# Altium schematic sheet adapter_board.SchDoc
size A3; SheetNumber: 2; SheetTotal: 3
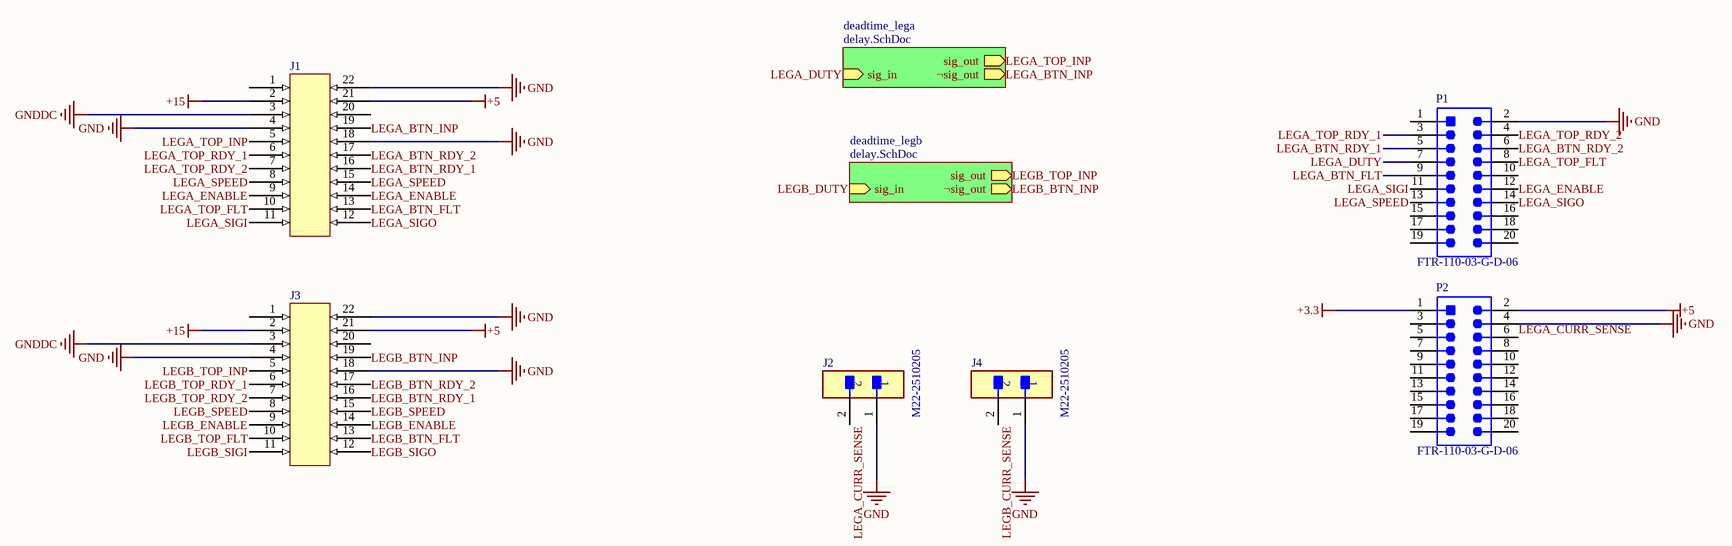
[diagram p0: adapter_board.SchDoc]

## Parts
J1  header_22_milligrid  [header_22_milligrid]  (value not drawn)
J2  M22-2510205  [FP-M22-2510205-MFG]
J3  header_22_milligrid  [header_22_milligrid]  (value not drawn)
J4  M22-2510205  [FP-M22-2510205-MFG]
P1  FTR-110-03-G-D-06  [SMTC-FTR-110-03-G-D-06_V]
P2  FTR-110-03-G-D-06  [SMTC-FTR-110-03-G-D-06_V]

## Sub-sheets
deadtime_lega = delay.SchDoc: sig_out (out), ¬sig_out (out), sig_in (in)
deadtime_legb = delay.SchDoc: sig_out (out), ¬sig_out (out), sig_in (in)

## Nets
+3.3: P2.1
+5: J1.21 J3.21 P2.2
+15: J1.2 J3.2
GND: J1.4 J1.18 J1.22 J2.1 J3.4 J3.18 J3.22 J4.1 P1.2 P2.4
GNDDC: J1.3 J3.3
LEGA_BTN_FLT: J1.13 P1.9
LEGA_BTN_INP: J1.19 ; sheet deadtime_lega/¬sig_out
LEGA_BTN_RDY_1: J1.16 P1.5
LEGA_BTN_RDY_2: J1.17 P1.6
LEGA_CURR_SENSE: J2.2 P2.6
LEGA_DUTY: P1.7 ; sheet deadtime_lega/sig_in
LEGA_ENABLE: J1.9 J1.14 P1.12
LEGA_SIGI: J1.11 P1.11
LEGA_SIGO: J1.12 P1.14
LEGA_SPEED: J1.8 J1.15 P1.13
LEGA_TOP_FLT: J1.10 P1.8
LEGA_TOP_INP: J1.5 ; sheet deadtime_lega/sig_out
LEGA_TOP_RDY_1: J1.6 P1.3
LEGA_TOP_RDY_2: J1.7 P1.4
LEGB_BTN_FLT: J3.13
LEGB_BTN_INP: J3.19 ; sheet deadtime_legb/¬sig_out
LEGB_BTN_RDY_1: J3.16
LEGB_BTN_RDY_2: J3.17
LEGB_CURR_SENSE: J4.2
LEGB_DUTY: sheet deadtime_legb/sig_in
LEGB_ENABLE: J3.9 J3.14
LEGB_SIGI: J3.11
LEGB_SIGO: J3.12
LEGB_SPEED: J3.8 J3.15
LEGB_TOP_FLT: J3.10
LEGB_TOP_INP: J3.5 ; sheet deadtime_legb/sig_out
LEGB_TOP_RDY_1: J3.6
LEGB_TOP_RDY_2: J3.7

Not connected (* = marked no-connect by the designer): J1 1 20; J3 1 20; P1 1 10 15 16 17 18 19 20; P2 3 5 7 8 9 10 11 12 13 14 15 16 17 18 19 20

## Notes on the sheet
- 1
- 2
- 3
- 4
- 5
- 6
- 7
- 8
- A
- B
- C
- D
- Project:
- Date:
- Drawing number:
- Rev:
- Format:
- A3
- Drawn by:
- Laboratory:
- Page
- Sheet:
- of
- File:

## Library data of the parts
J2 J4 = CMP-15831-000005-1: CONN HEADER VERT 2POS 2MM; Manufacturer: Harwin; Conn Gender: Male; Current Rating: 2A; Number Of Contacts: 2; Conn Orientation: Vertical; Temperature Range Low: -40°C; Device Class L1: Connectors; ComponentLink2URL: https://cdn.harwin.com/pdfs/C018XX_M22_Series_Connectors.pdf; Temperature Range High: +105°C; Pitch: 2mm; Number Of Rows: 1; Temperature: -40°C to +105°C; Automotive: No; Device Class L3: unset; Octopart: https://octopart.com/m22-2510205-harwin-2538221; Mouser Description: Headers & Wire Housings 2 PIN SIL VERTICAL GOLD PIN HEADER; Height: 5.45mm; Category: Conn; Digikey Description: CONN HEADER VERT 2POS 2MM; Contact Material: Gold,Nickel; Lead Free: Yes; ComponentLink2Description: Datasheet; Manufacturer Part Number: M22-2510205; Device Class L2: Headers and Wire Housings; Package: 0; Footprint Url: https://cdn.harwin.com/pdfs/M22-251.pdf; RoHS: TRUE
P1 P2 = CMP-2000-06291-2: Male Header, Pitch 1.27 mm, 2 x 10 Position, 19 Loaded Position, Height 7.02 mm, -55 to 125 degC, RoHS, Tube; Manufacturer: Samtec; Row Spacing: 0.100"(2.54mm); Online Catalog: FTRSeries; Number of Positions Loaded: 19; Number of Positions: 20; Connector Type: Unshrouded; Other Names: FTR-110-03-G-D-06-NDSAM8790; Pitch: 0.050"(1.27mm); Family: Rectangular-BoardtoBoardConnectors-Headers,MalePins; Packaging: Tube; Mounting Technology: SurfaceMount; Features: -; Standard Package: 1; Mounting Type: SurfaceMount; Termination: Solder; Datasheet URL: http://suddendocs.samtec.com/catalog_english/ftr_smt.pdf; Number of Rows: 2; Manufacturer URL: http://www.samtec.com/; Color: Black; Datasheet Version: 02/2016; Package URL: http://suddendocs.samtec.com/prints/ftr-1xx-xx-xx-d-x-xx-mkt.pdf; Contact Mating Length: 0.125"(3.18mm); Series: FTR; Height Stacking (Mating): -; Contact Finish Thickness: 10µin(0.25µm); Category: Connectors,Interconnects; Molding Height Above Board: 0.100"(2.54mm); Package Reference: FTR-110-03-G-D-06; Contact Finish: Gold; Package Description: Male Header, Pitch 1.27 mm, 2 x 10 Position, 19 Loaded Position, Height 7.02 mm
J1 J3 = header_22_milligrid: Supplier 1: Digi-Key; Supplier Part Number 1: 23-0877592250-ND